# Altium schematic sheet Output_stage.SchDoc
size A0
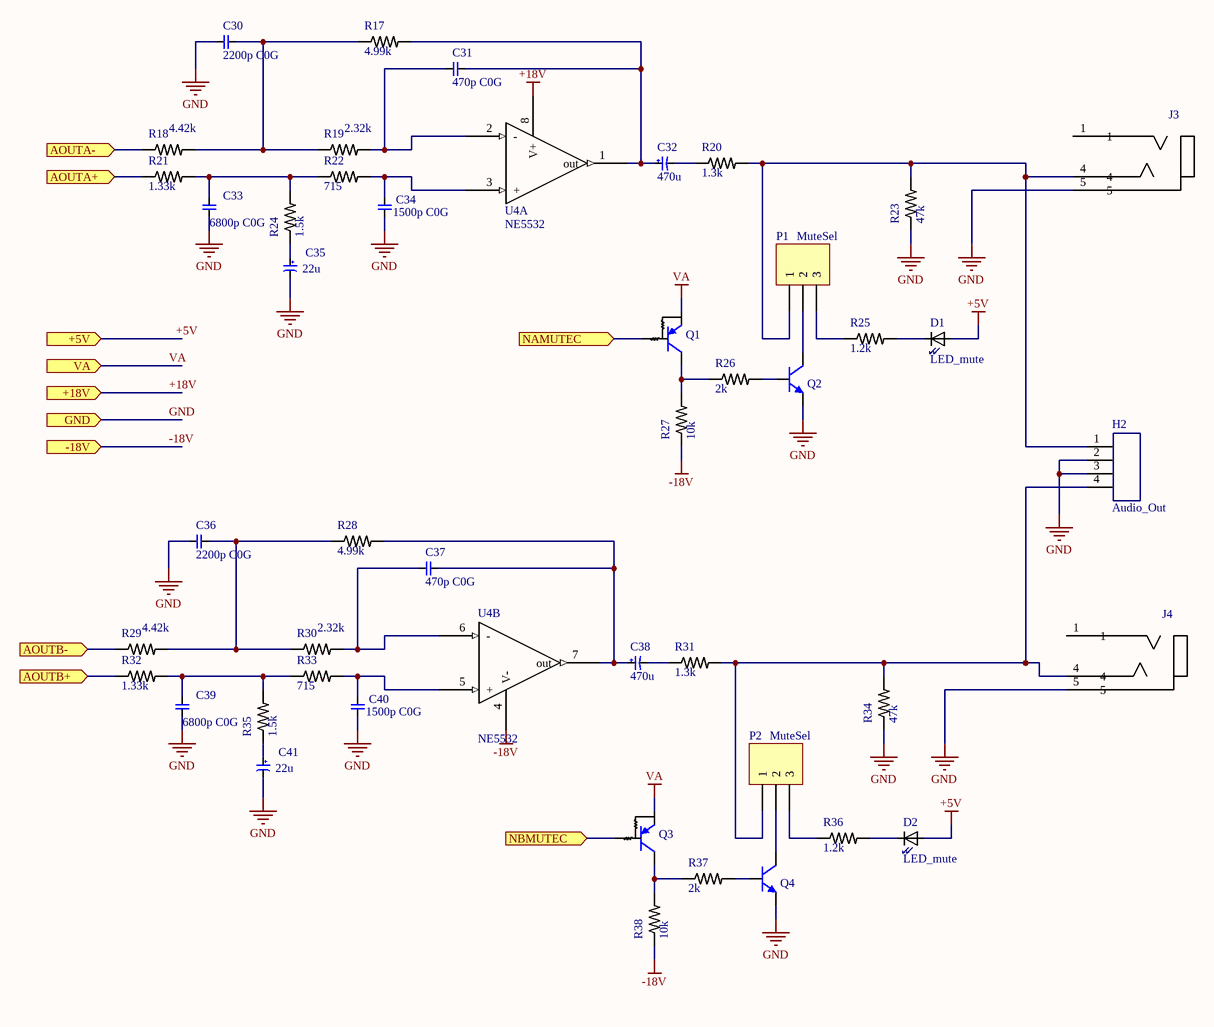
[diagram p0: Output_stage.SchDoc]

## Parts
C30  2200p C0G  [0805_cap]
C31  470p C0G  [0805_cap]
C32  470u  [cap 4x5.4]
C33  6800p C0G  [0805_cap]
C34  1500p C0G  [0805_cap]
C35  22u  [cap 4x5.4]
C36  2200p C0G  [0805_cap]
C37  470p C0G  [0805_cap]
C38  470u  [cap 4x5.4]
C39  6800p C0G  [0805_cap]
C40  1500p C0G  [0805_cap]
C41  22u  [cap 4x5.4]
D1  LED_mute  [1206]
D2  LED_mute  [1206]
H2  Audio_Out  [header-4_male]
J3  35RASMT2BHNTRX  [SWITCHCRAFT_35RASMT2BHNTRX]  (value not drawn)
J4  35RASMT2BHNTRX  [SWITCHCRAFT_35RASMT2BHNTRX]  (value not drawn)
P1  MuteSel  [HDR1X3]
P2  MuteSel  [HDR1X3]
Q1  MMUN2111LT1G  [SOT-23]  (value not drawn)
Q2  MMBT5551  [SOT-23]  (value not drawn)
Q3  MMUN2111LT1G  [SOT-23]  (value not drawn)
Q4  MMBT5551  [SOT-23]  (value not drawn)
R17  4.99k  [0805]
R18  4.42k  [0805]
R19  2.32k  [0805]
R20  1.3k  [0805]
R21  1.33k  [0805]
R22  715  [0805]
R23  47k  [0805]
R24  1.5k  [0805]
R25  1.2k  [0805]
R26  2k  [0805]
R27  10k  [0805]
R28  4.99k  [0805]
R29  4.42k  [0805]
R30  2.32k  [0805]
R31  1.3k  [0805]
R32  1.33k  [0805]
R33  715  [0805]
R34  47k  [0805]
R35  1.5k  [0805]
R36  1.2k  [0805]
R37  2k  [0805]
R38  10k  [0805]
U4  NE5532  [SOIC-8]  (parts A,B of 2)

## Ports
+5V (in), +18V (in), -18V (in), AOUTA+ (in), AOUTA- (in), AOUTB+ (in), AOUTB- (in), GND (in), NAMUTEC (in), NBMUTEC (in), VA (in)

## Nets
+5V: D1.1 D2.1 ; port +5V
+18V: U4.8(V+) ; port +18V
-18V: R27.1 R38.1 U4.4(V-) ; port -18V
GND: C30.2 C33.1 C34.1 C35.2 C36.2 C39.1 C40.1 C41.2 H2.2 H2.3 J3.5 J4.5 Q2.2(E) Q4.2(E) R23.1 R34.1 ; port GND
VA: Q1.2(E) Q3.2(E) ; port VA
AOUTA+: R21.1 ; port AOUTA+
AOUTA-: R18.1 ; port AOUTA-
AOUTB+: R32.1 ; port AOUTB+
AOUTB-: R29.1 ; port AOUTB-
NAMUTEC: Q1.1(B) ; port NAMUTEC
NBMUTEC: Q3.1(B) ; port NBMUTEC
NetC30_1: C30.1 R17.1 R18.2 R19.1
NetC31_1: C31.1 C32.1 R17.2 U4.1(out)
NetC31_2: C31.2 R19.2 U4.2(-)
NetC32_2: C32.2 R20.1
NetC33_2: C33.2 R21.2 R22.1 R24.2
NetC34_2: C34.2 R22.2 U4.3(+)
NetC35_1: C35.1 R24.1
NetC36_1: C36.1 R28.1 R29.2 R30.1
NetC37_1: C37.1 C38.1 R28.2 U4.7(out)
NetC37_2: C37.2 R30.2 U4.6(-)
NetC38_2: C38.2 R31.1
NetC39_2: C39.2 R32.2 R33.1 R35.2
NetC40_2: C40.2 R33.2 U4.5(+)
NetC41_1: C41.1 R35.1
NetD1_2: D1.2 R25.2
NetD2_2: D2.2 R36.2
NetH2_1: H2.1 J3.4 P1.1 R20.2 R23.2
NetH2_4: H2.4 J4.4 P2.1 R31.2 R34.2
NetP1_2: P1.2 Q2.3(C)
NetP1_3: P1.3 R25.1
NetP2_2: P2.2 Q4.3(C)
NetP2_3: P2.3 R36.1
NetQ1_3: Q1.3(C) R26.1 R27.2
NetQ2_1: Q2.1(B) R26.2
NetQ3_3: Q3.3(C) R37.1 R38.2
NetQ4_1: Q4.1(B) R37.2

Not connected (* = marked no-connect by the designer): J3 1; J4 1

## Library data of the parts
C30 C31 C33 C34 C36 C37 C39 C40 = Cap
C32 C35 C38 C41 = Cap_electrolytic
D1 D2 = LED
H2 = arduino_header_4
J3 J4 = 3.5mm jack stereo smd: Conn 3.5MM Stereo Jack F 3 POS Solder RA SMD 3 Terminal 1 Port T/R; MF: Switchcraft; MP: 35RASMT2BHNTRX; Package: None; Price: 0.84 USD; Availability: Good; SnapEDA_Link: https://www.snapeda.com/parts/35RASMT2BHNTRX/Switchcraft%20Inc./view-part/?ref=snap; Value: *
P1 P2 = Header 3: Header, 3-Pin; LatestRevisionDate: 17-Jul-2002; LatestRevisionNote: Re-released for DXP Platform.; Publisher: Altium Limited
R17-R38 = res my: RES SMD  1/8W 0805; MF: Yageo; MP: AC0805JR-070RL; Package: 0805 Yageo; Price: 0.01 USD; Availability: Good; Value: *
U4 = OPA2277